# Altium schematic sheet FIT_HDMI_X27-23.SchDoc: FIT_PM12 board
size 420 x 297 mm; CheckedBy: G.Kasprowicz; Author: INR Moscow; CompanyName: WUT ISE; DrawnBy: M.Podgórski; Organization: WUT ISE; Address1: PW ISE; Address2: Nowowiejska 15/19 00-665 Warsaw; Address3: gkasprow@gmail.com; Revision: 2; SheetNumber: -; SheetTotal: -; ModifiedBy: -; CheckedDate: -; Title2: Title 2; DivGrp: WUT ISE; Designer: INR RAS; ModifiedDate: -; ProjectName: Sensor Box
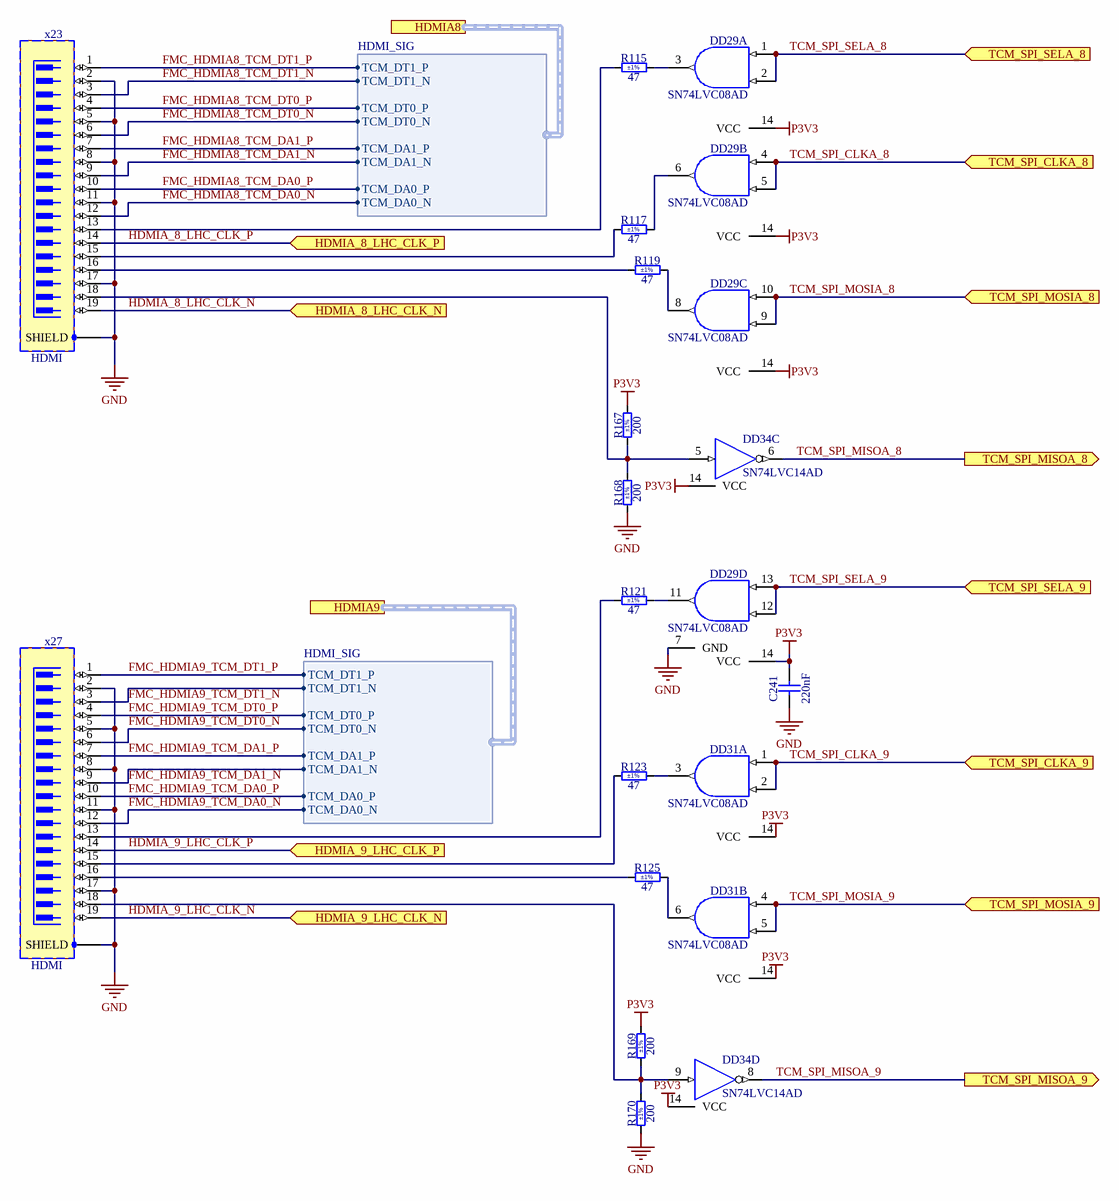
[diagram p0: FIT_HDMI_X27-23.SchDoc]

## Parts
C241  220nF  [CAPC2012X135N]
DD29  SN74LVC08AD  [SOIC127P600X175-14N]  (parts A,B,C,D of 4)
DD31  SN74LVC08AD  [SOIC127P600X175-14N]  (parts A,B of 4)
DD34  SN74LVC14AD  [SOIC127P600X175-14N]  (parts C,D of 6)
R115  47  Tolerance: ±1%  [RESC2012X60N]
R117  47  Tolerance: ±1%  [RESC2012X60N]
R119  47  Tolerance: ±1%  [RESC2012X60N]
R121  47  Tolerance: ±1%  [RESC2012X60N]
R123  47  Tolerance: ±1%  [RESC2012X60N]
R125  47  Tolerance: ±1%  [RESC2012X60N]
R167  200  Tolerance: ±1%  [RESC2012X60N]
R168  200  Tolerance: ±1%  [RESC2012X60N]
R169  200  Tolerance: ±1%  [RESC2012X60N]
R170  200  Tolerance: ±1%  [RESC2012X60N]
x23  HDMI  [TYCO_2007435-1]
x27  HDMI  [TYCO_2007435-1]

## Ports
HDMIA8 (harness HDMI_SIG), HDMIA9 (harness HDMI_SIG), HDMIA_8_LHC_CLK_N (in), HDMIA_8_LHC_CLK_P (in), HDMIA_9_LHC_CLK_N (in), HDMIA_9_LHC_CLK_P (in), TCM_SPI_CLKA_8 (in), TCM_SPI_CLKA_9 (in), TCM_SPI_MISOA_8 (out), TCM_SPI_MISOA_9 (out), TCM_SPI_MOSIA_8 (in), TCM_SPI_MOSIA_9 (in), TCM_SPI_SELA_8 (in), TCM_SPI_SELA_9 (in)

## Harnesses
HDMI_SIG: TCM_DT1_P, TCM_DT1_N, TCM_DT0_P, TCM_DT0_N, TCM_DA1_P, TCM_DA1_N, TCM_DA0_P, TCM_DA0_N

## Nets
GND: C241.1 DD29.7(GND) DD31.7(GND) DD34.7(GND) R168.1 R170.1 x23.2 x23.5 x23.8 x23.11 x23.17 x23.SHIELD x27.2 x27.5 x27.8 x27.11 x27.17 x27.SHIELD
P3V3: C241.2 DD29.14(VCC) DD31.14(VCC) DD34.14(VCC) R167.2 R169.2  [also labelled VCC]
FMC_HDMIA8_TCM_DA0_N: x23.12 ; port HDMIA8.TCM_DA0_N
FMC_HDMIA8_TCM_DA0_P: x23.10 ; port HDMIA8.TCM_DA0_P
FMC_HDMIA8_TCM_DA1_N: x23.9 ; port HDMIA8.TCM_DA1_N
FMC_HDMIA8_TCM_DA1_P: x23.7 ; port HDMIA8.TCM_DA1_P
FMC_HDMIA8_TCM_DT0_N: x23.6 ; port HDMIA8.TCM_DT0_N
FMC_HDMIA8_TCM_DT0_P: x23.4 ; port HDMIA8.TCM_DT0_P
FMC_HDMIA8_TCM_DT1_N: x23.3 ; port HDMIA8.TCM_DT1_N
FMC_HDMIA8_TCM_DT1_P: x23.1 ; port HDMIA8.TCM_DT1_P
FMC_HDMIA9_TCM_DA0_N: x27.12 ; port HDMIA9.TCM_DA0_N
FMC_HDMIA9_TCM_DA0_P: x27.10 ; port HDMIA9.TCM_DA0_P
FMC_HDMIA9_TCM_DA1_N: x27.9 ; port HDMIA9.TCM_DA1_N
FMC_HDMIA9_TCM_DA1_P: x27.7 ; port HDMIA9.TCM_DA1_P
FMC_HDMIA9_TCM_DT0_N: x27.6 ; port HDMIA9.TCM_DT0_N
FMC_HDMIA9_TCM_DT0_P: x27.4 ; port HDMIA9.TCM_DT0_P
FMC_HDMIA9_TCM_DT1_N: x27.3 ; port HDMIA9.TCM_DT1_N
FMC_HDMIA9_TCM_DT1_P: x27.1 ; port HDMIA9.TCM_DT1_P
HDMIA_8_LHC_CLK_N: x23.19 ; port HDMIA_8_LHC_CLK_N
HDMIA_8_LHC_CLK_P: x23.14 ; port HDMIA_8_LHC_CLK_P
HDMIA_9_LHC_CLK_N: x27.19 ; port HDMIA_9_LHC_CLK_N
HDMIA_9_LHC_CLK_P: x27.14 ; port HDMIA_9_LHC_CLK_P
TCM_SPI_CLKA_8: DD29.4(A) DD29.5(B) ; port TCM_SPI_CLKA_8
TCM_SPI_CLKA_9: DD31.1(A) DD31.2(B) ; port TCM_SPI_CLKA_9
TCM_SPI_MISOA_8: DD34.6(OUT) ; port TCM_SPI_MISOA_8
TCM_SPI_MISOA_9: DD34.8(OUT) ; port TCM_SPI_MISOA_9
TCM_SPI_MOSIA_8: DD29.9(B) DD29.10(A) ; port TCM_SPI_MOSIA_8
TCM_SPI_MOSIA_9: DD31.4(A) DD31.5(B) ; port TCM_SPI_MOSIA_9
TCM_SPI_SELA_8: DD29.1(A) DD29.2(B) ; port TCM_SPI_SELA_8
TCM_SPI_SELA_9: DD29.12(B) DD29.13(A) ; port TCM_SPI_SELA_9
NetDD29_3: DD29.3(Y) R115.2
NetDD29_6: DD29.6(Y) R117.2
NetDD29_8: DD29.8(Y) R119.2
NetDD29_11: DD29.11(Y) R121.2
NetDD31_3: DD31.3(Y) R123.2
NetDD31_6: DD31.6(Y) R125.2
NetDD34_5: DD34.5(IN) R167.1 R168.2 x23.18
NetDD34_9: DD34.9(IN) R169.1 R170.2 x27.18
NetR115_1: R115.1 x23.13
NetR117_1: R117.1 x23.15
NetR119_1: R119.1 x23.16
NetR121_1: R121.1 x27.13
NetR123_1: R123.1 x27.15
NetR125_1: R125.1 x27.16

## Notes on the sheet
- Project/Equipment
- Document
- Designer
- Drawn by
- Check.by
- Copyright WUT ISE 2024.
  This documentation describes Open Hardware and is licensed under the CERN OHL v.2. You may redistribute and modify this documentation under the terms of the CERN OHL v.2. (http://ohwr.org/CERNOHL). This documentation is distributed WITHOUT ANY EXPRESS OR IMPLIED WARRANTY, INCLUDING OF MERCHANTABILITY, SATISFACTORY QUALITY AND FITNESS FOR A PARTICULAR PURPOSE. Please see the CERN OHL v.2 for applicable conditions.
- Contact
- File
- Last Mod.
- Print Date
- Sheet
- Size
- A3
- of
- Rev

## Library data of the parts
C241 = CC0805_220NF_50V_10%_X7R: Non-polarised capacitor; Part Description: SMD Multilayer Chip Ceramic Capacitor; Manufacturer: GENERIC; Manufacturer1 Part Number: GRM21BR71H224KA01L; Voltage: 50V; TC: X7R; Tolerance: ±10%; Part Number: CC0805_220NF_50V_10%_X7R; Component Kind: Standard; Component Type: Standard; Pin Count: 2; Value: 220nF; Status: Preferred; Manufacturer Part Number: CC0805_220NF_50V_10%_X7R; Case: 0805; Mounted: Yes; Socket: No; SMD: Yes; Sense: No; Manufacturer1 Example: MURATA; Manufacturer1 ComponentHeight: 1.35mm; HelpURL: \\cern.ch\dfs\Applications\Altium\Datasheets\CC0805_X7R_MURATA.pdf; Author: CERN DEM JLC; CreateDate: 03.12.2007; LatestRevisionDate: 03.12.2007
DD29 DD31 = SN74LVC08AD: Quad 2-Input AND Gate; Part Description: Quadruple 2-Input Positive-AND Gate; Manufacturer: TEXAS INSTRUMENTS; PressFit: No; Bonding: No; Part Number: SN74LVC08AD; Component Kind: Standard; Component Type: Standard; Device: SN74LVC08AD; PackageDescription: SOIC 14, Pitch 1.27mm - Body 4x8.75mm, IPC Medium Density; Manufacturer Part Number: SN74LVC08AD; Pin Count: 14; Case: SOIC14; Mounted: Yes; Socket: No; SMD: Yes; Sense: No; ComponentHeight: 1.75mm; Author: CERN DEM JLC; HelpURL: \\cern.ch\dfs\Applications\Altium\Datasheets\SN74LVC08AD.pdf; CreateDate: 21.03.2012; LatestRevisionDate: 21.03.2012
DD34 = SN74LVC14AD: Hex Schmitt-Trigger Inverter; Manufacturer: TEXAS INSTRUMENTS; PressFit: No; Bonding: No; Part Number: SN74LVC14AD; Component Kind: Standard; Component Type: Standard; Device: SN74LVC14AD; PackageDescription: SOIC 14, Pitch 1.27mm - Body 4x8.75mm, IPC Medium Density; Part Description: Hex Schmitt-Trigger Inverter; Manufacturer Part Number: SN74LVC14AD; Pin Count: 14; Case: SOIC14; Mounted: Yes; Socket: No; SMD: Yes; Sense: No; ComponentHeight: 1.75mm; Author: CERN DEM JMW; HelpURL: \\cern.ch\dfs\Applications\Altium\Datasheets\SN74LVC14AD.pdf; CreateDate: 29.09.2008; LatestRevisionDate: 29.09.2008
R115 R117 R119 R121 R123 R125 = R0805_47R_1%_0.125W_100PPM: Resistor - 1%; Part Description: General Purpose Thick Film Chip Resistor; Manufacturer: GENERIC; Manufacturer1 Part Number: NRC10F47R0TRF; Power: 0.125W; TC: ±100ppm/°C; PressFit: No; Part Number: R0805_47R_1%_0.125W_100PPM; Component Kind: Standard; Component Type: Standard; Pin Count: 2; Value: 47; Status: Preferred; Manufacturer Part Number: R0805_47R_1%_0.125W_100PPM; Case: 0805; Mounted: Yes; Sense: No; Socket: No; SMD: Yes; Manufacturer1 Example: NIC COMPONENT; Manufacturer1 ComponentHeight: 0.6mm; HelpURL: \\cern.ch\dfs\Applications\Altium\Datasheets\R0805_NIC_NRC.pdf; Author: CERN DEM JLC; CreateDate: 03.12.2007; LatestRevisionDate: 13.03.2008
R167-R170 = R0805_200R_1%_0.125W_100PPM: Resistor - 1%; Part Description: General Purpose Thick Film Chip Resistor; Manufacturer: GENERIC; Manufacturer1 Part Number: NRC10F2000TRF; Power: 0.125W; TC: ±100ppm/°C; PressFit: No; Part Number: R0805_200R_1%_0.125W_100PPM; Component Kind: Standard; Component Type: Standard; Pin Count: 2; Value: 200; Status: Preferred; Manufacturer Part Number: R0805_200R_1%_0.125W_100PPM; Case: 0805; Mounted: Yes; Sense: No; Socket: No; SMD: Yes; Manufacturer1 Example: NIC COMPONENT; Manufacturer1 ComponentHeight: 0.6mm; HelpURL: \\cern.ch\dfs\Applications\Altium\Datasheets\R0805_NIC_NRC.pdf; Author: CERN DEM JLC; CreateDate: 03.12.2007; LatestRevisionDate: 13.03.2008
x23 x27 = TYCO_2007435-1: Connector HDMI 19 Male + 1 Shield; Part Description: 0.578mm Pitch, Through-Hole Right Angle 19 Contacts Flag-HDMI Type-A Receptacle Thru Hole Mounting Pads; Manufacturer: TYCO ELECTRONICS; PressFit: No; Part Number: TYCO_2007435-1; Component Kind: Standard; Component Type: Standard; Pin Count: 23; Family: HDMI; Mounted: Yes; Socket: No; SMD: No; Sense: No; Status: None; Manufacturer Part Number: 2007435-1; ComponentHeight: 16.4mm; HelpURL: \\cern.ch\dfs\Applications\Altium\Datasheets\TYCO_2007435-1.pdf; Author: CERN DEM MR; CreateDate: 05.07.2016; LatestRevisionDate: 05.07.2016